# Altium schematic sheet IoT_Board_ESP32.SchDoc
size 420 x 297 mm; SheetNumber: 1; SheetTotal: 13
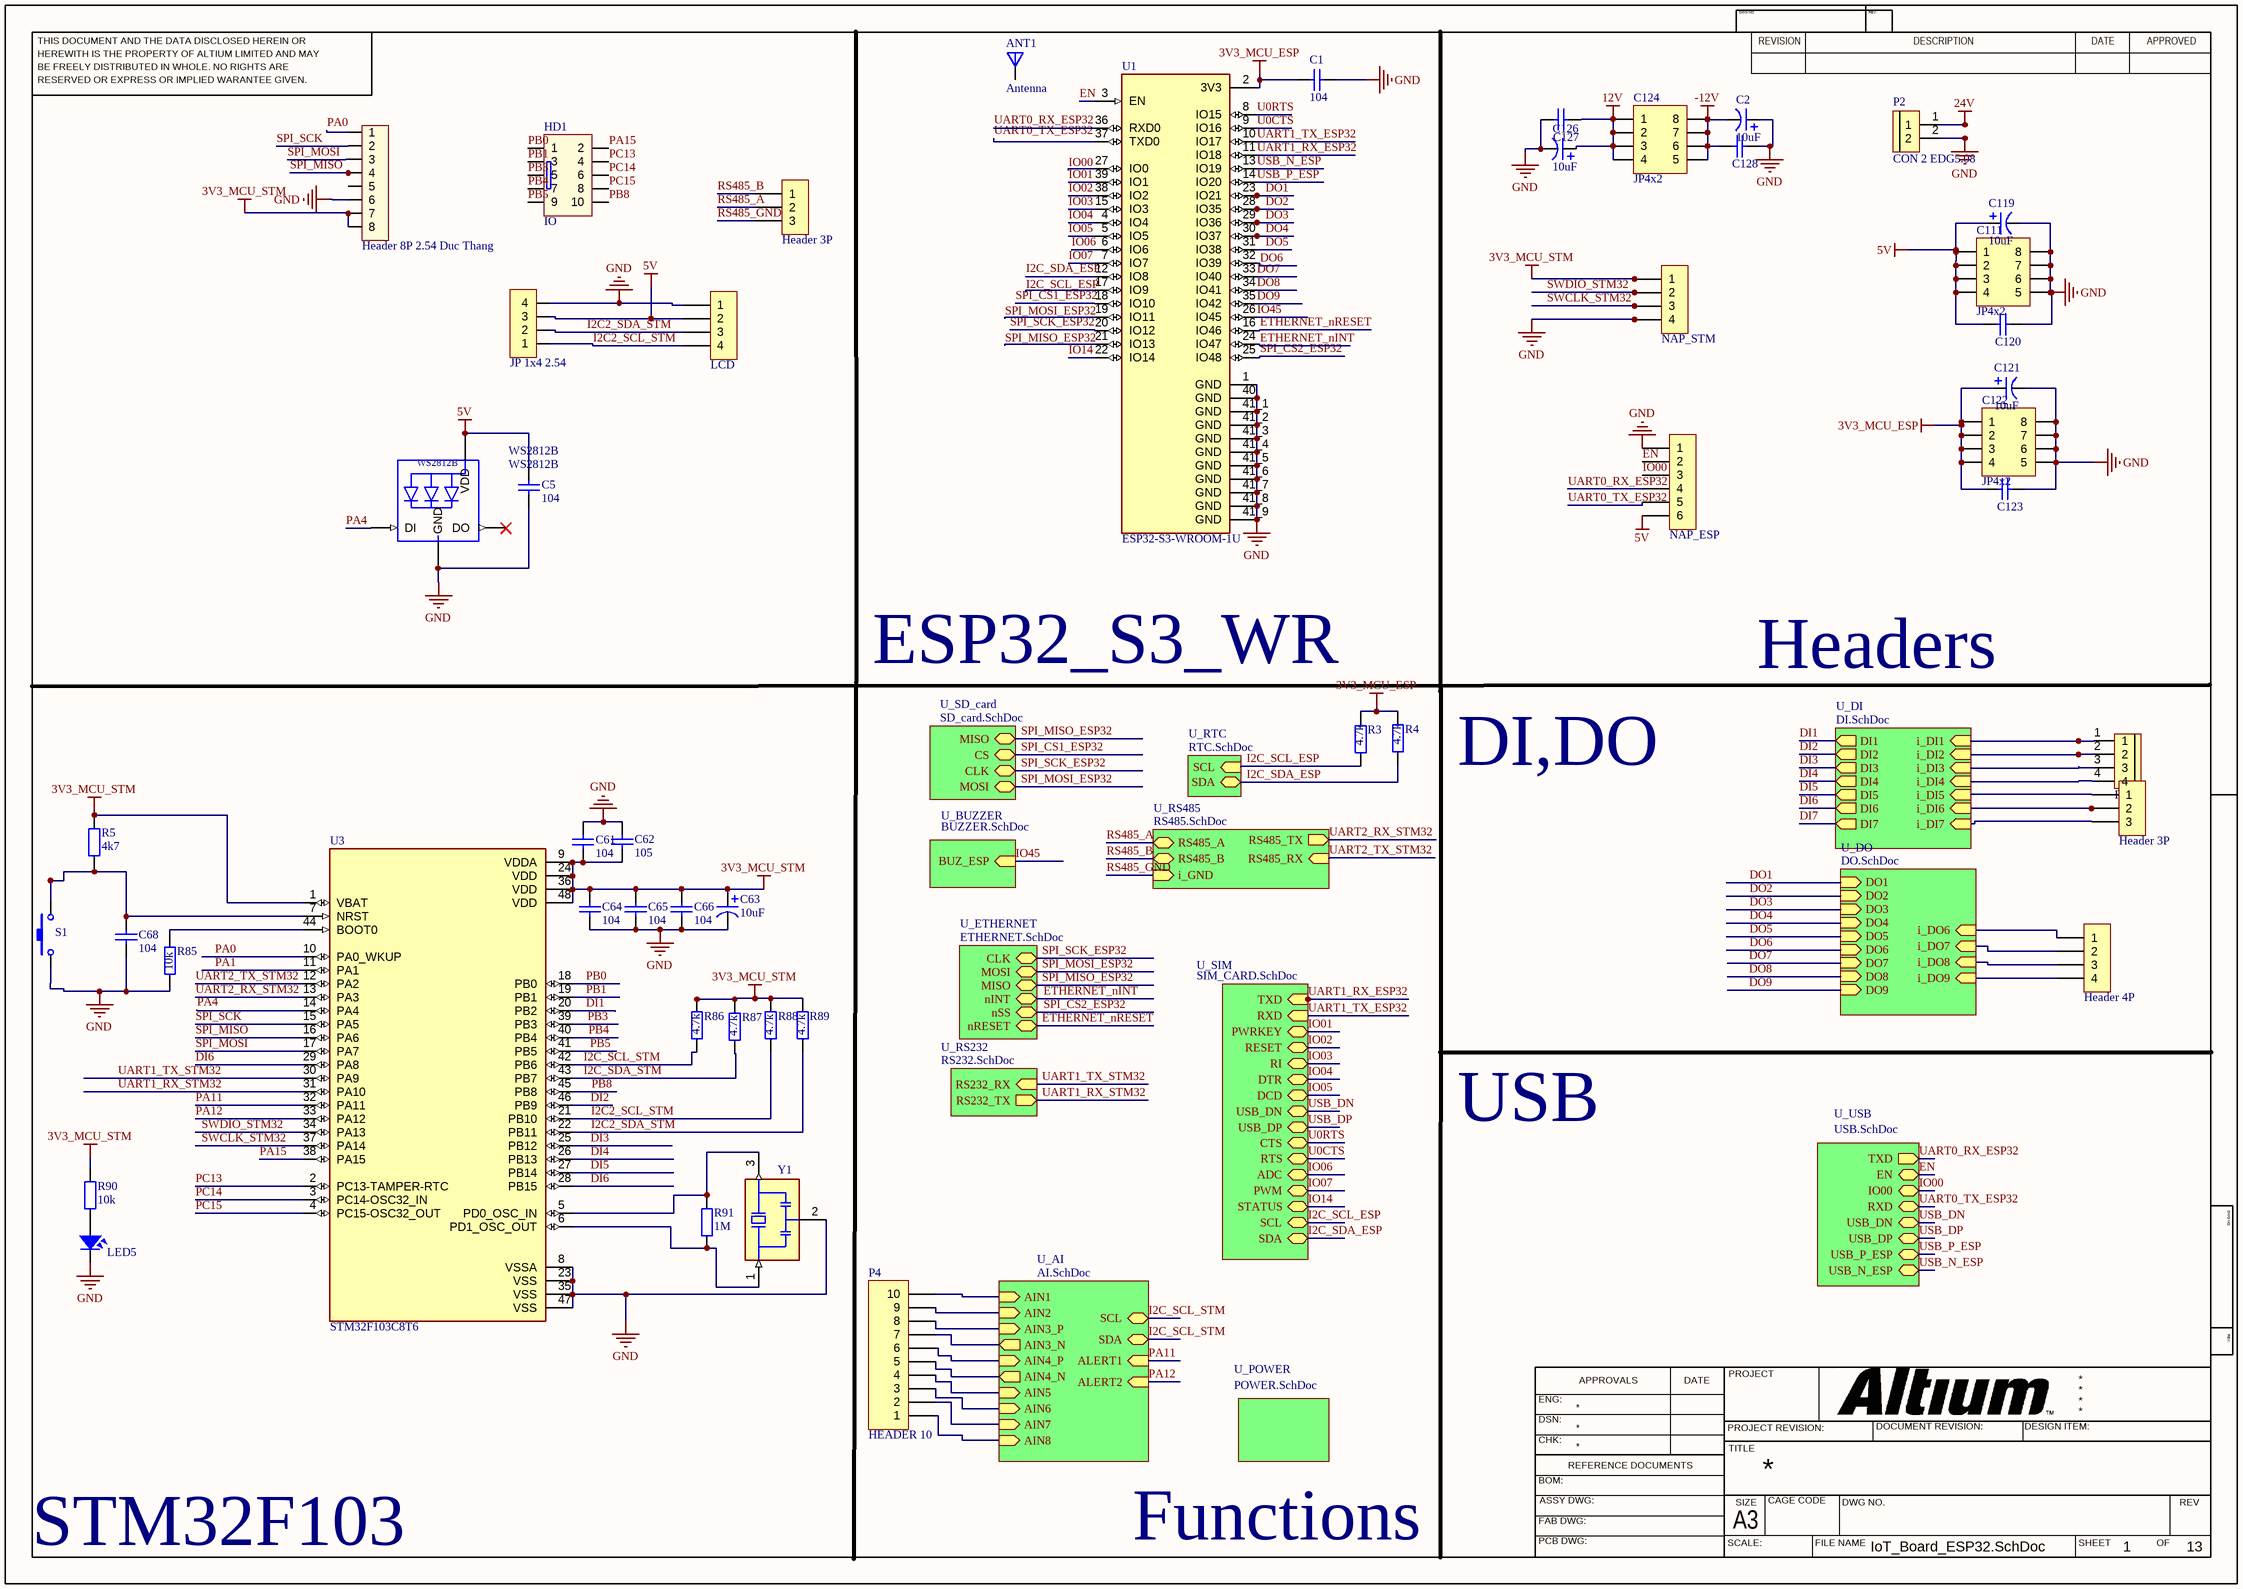
[diagram p0: IoT_Board_ESP32.SchDoc]

## Parts
ANT1  Antenna  [ANTENNA]
C1  104  [0603_Cap]
C2  10uF  [1206_CAP]
C5  104  [0603_Cap]
C61  104  [0603_Cap]
C62  105  [0603_Cap]
C63  10uF  [1206_CAP]
C64  104  [0603_Cap]
C65  104  [0603_Cap]
C66  104  [0603_Cap]
C68  104  [0603_Cap]
C111  JP4x2  [JP4-D2T]
C119  10uF  [1206_CAP]
C120  105  [0805_Cap]  (value not drawn)
C121  10uF  [1206_CAP]
C122  JP4x2  [JP4-D2T]
C123  105  [0805_Cap]  (value not drawn)
C124  JP4x2  [JP4-D2T]
C126  10uF  [1206_CAP]
C127  105  [0805_Cap]  (value not drawn)
C128  105  [0805_Cap]  (value not drawn)
H1  NAP_ESP  [XH2.54M-6]
H2  Header 3P  [CON 3 EDG5.08-3P]
H3  NAP_STM  [XH2.54M-4]
H4  Header 8P 2.54 Duc Thang  [XH2.54M-8]
H5  LCD  [XH2.54M-4]
H7  Header 3P  [CON 3 EDG5.08-3P]
H25  Header 4P  [CON 4 EDG5.08-4P]
HD1  IO  [IDC10]
JP1  JP 1x4 2.54  [JP 1x4 DT]
LED5  LED  [0603_LED]  (value not drawn)
P2  CON 2 EDG5.08  [CON 2 2EDG5.08]
P3  CON 4 EDG5.08  [CON 4 4EDG5.08]  (value not drawn)
P4  HEADER 10  [HT508R-10P]
R3  4.7k  [0603_Res]
R4  4.7k  [0603_Res]
R5  4k7  [0603_Res]
R85  10k  [0603_Res]
R86  4.7k  [0603_Res]
R87  4.7k  [0603_Res]
R88  4.7k  [0603_Res]
R89  4.7k  [0603_Res]
R90  10k  [0603_Res]
R91  1M  [0603_Res]
S1  SW  [BUTTON-SMD 2PIN]  (value not drawn)
U1  ESP32-S3-WROOM-1U  [XCVR_ESP32-S3-WROOM-1U]
U3  STM32F103C8T6  [LQFP-48]
WS2812B  WS2812B  [WS2812B]
Y1  CSTCE8M00G52-R0  [OSC_CSTCE8M00G52-R0]  (value not drawn)

## Sub-sheets
U_AI = AI.SchDoc: AIN1 (in), SCL (bidir), SDA (bidir), AIN2 (in), AIN3_P (in), AIN3_N (out), AIN4_P (in), AIN4_N (out), AIN5 (in), AIN6 (in), ALERT1 (in), ALERT2 (in), AIN7 (in), AIN8 (in)
U_BUZZER = BUZZER.SchDoc: BUZ_ESP (in)
U_DI = DI.SchDoc: i_DI1 (in), i_DI2 (in), i_DI3 (in), i_DI4 (in), DI1 (out), DI2 (out), DI3 (out), DI4 (out), i_DI5 (in), i_DI6 (in), DI5 (out), DI6 (out), DI7 (out), i_DI7 (in)
U_DO = DO.SchDoc: DO6 (in), DO5 (in), DO4 (in), DO3 (in), DO2 (in), DO1 (in), DO7 (in), DO8 (in), DO9 (in), i_DO8 (in), i_DO9 (in), i_DO7 (in), i_DO6 (in)
U_ETHERNET = ETHERNET.SchDoc: nRESET (bidir), nSS (bidir), nINT (bidir), MISO (bidir), MOSI (bidir), CLK (bidir)
U_POWER = POWER.SchDoc: no entries
U_RS232 = RS232.SchDoc: RS232_RX (in), RS232_TX (out)
U_RS485 = RS485.SchDoc: RS485_A (bidir), RS485_B (bidir), RS485_TX (out), RS485_RX (in), i_GND (in)
U_RTC = RTC.SchDoc: SCL (in), SDA (bidir)
U_SD_card = SD_card.SchDoc: CS (bidir), MOSI (bidir), CLK (bidir), MISO (bidir)
U_SIM = SIM_CARD.SchDoc: RXD (in), PWRKEY (bidir), RESET (bidir), RI (bidir), DTR (bidir), DCD (bidir), USB_DN (bidir), USB_DP (bidir), TXD (in), CTS (bidir), RTS (bidir), ADC (bidir), PWM (bidir), STATUS (bidir), SCL (bidir), SDA (bidir)
U_USB = USB.SchDoc: TXD (out), EN (bidir), IO00 (bidir), RXD (bidir), USB_DN (bidir), USB_DP (bidir), USB_P_ESP (bidir), USB_N_ESP (bidir)

## Nets
3V3_MCU_ESP: C1.2 C121.1 C122.1 C122.2 C122.3 C122.4 C123.1 R3.2 R4.2 U1.2(3V3)
3V3_MCU_STM: C61.2 C62.2 C63.1 C64.1 C65.1 C66.1 H3.1 H4.7 H4.8 R5.2 R86.2 R87.2 R88.2 R89.2 R90.2 U3.1(VBAT) U3.9(VDDA) U3.24(VDD) U3.36(VDD) U3.48(VDD)
5V: C5.1 C111.1 C111.2 C111.3 C111.4 C119.1 C120.1 H1.6 H5.2 JP1.3 WS2812B.1-VDD(VDD)
12V: C124.1 C124.2 C124.3 C124.4 C126.1 C127.1
24V: P2.1
-12V: C2.2 C124.5 C124.6 C124.7 C124.8 C128.1
GND: C1.1 C2.1 C5.2 C61.1 C62.1 C63.2 C64.2 C65.2 C66.2 C68.1 C111.5 C111.6 C111.7 C111.8 C119.2 C120.2 C121.2 C122.5 C122.6 C122.7 C122.8 C123.2 C126.2 C127.2 C128.2 H1.1 H3.4 H4.6 H5.1 JP1.4 LED5.C(Cathode) P2.2 R85.1 S1.1 U1.1(GND) U1.40(GND) U1.41_1(GND) U1.41_2(GND) U1.41_3(GND) U1.41_4(GND) U1.41_5(GND) U1.41_6(GND) U1.41_7(GND) U1.41_8(GND) U1.41_9(GND) U3.8(VSSA) U3.23(VSS) U3.35(VSS) U3.47(VSS) WS2812B.3-GND(GND) Y1.2(GND)
DI1: U3.20(PB2) ; sheet U_DI/DI1
DI2: U3.46(PB9) ; sheet U_DI/DI2
DI3: U3.25(PB12) ; sheet U_DI/DI3
DI4: U3.26(PB13) ; sheet U_DI/DI4
DI5: U3.27(PB14) ; sheet U_DI/DI5
DI6: U3.28(PB15) U3.29(PA8) ; sheet U_DI/DI6
DI7: sheet U_DI/DI7
DO1: U1.23(IO21) ; sheet U_DO/DO1
DO2: U1.28(IO35) ; sheet U_DO/DO2
DO3: U1.29(IO36) ; sheet U_DO/DO3
DO4: U1.30(IO37) ; sheet U_DO/DO4
DO5: U1.31(IO38) ; sheet U_DO/DO5
DO6: U1.32(IO39) ; sheet U_DO/DO6
DO7: U1.33(IO40) ; sheet U_DO/DO7
DO8: U1.34(IO41) ; sheet U_DO/DO8
DO9: U1.35(IO42) ; sheet U_DO/DO9
EN: H1.2 U1.3(EN) ; sheet U_USB/EN
ETHERNET_nINT: U1.24(IO47) ; sheet U_ETHERNET/nINT
ETHERNET_nRESET: U1.16(IO46) ; sheet U_ETHERNET/nRESET
I2C2_SCL_STM: H5.4 JP1.1 R88.1 U3.21(PB10)
I2C2_SDA_STM: H5.3 JP1.2 R89.1 U3.22(PB11)
I2C_SCL_ESP: R3.1 U1.17(IO9) ; sheet U_RTC/SCL, sheet U_SIM/SCL
I2C_SCL_STM: R86.1 U3.42(PB6) ; sheet U_AI/SCL, sheet U_AI/SDA
I2C_SDA_ESP: R4.1 U1.12(IO8) ; sheet U_RTC/SDA, sheet U_SIM/SDA
I2C_SDA_STM: R87.1 U3.43(PB7)
IO00: H1.3 U1.27(IO0) ; sheet U_USB/IO00
IO01: U1.39(IO1) ; sheet U_SIM/PWRKEY
IO02: U1.38(IO2) ; sheet U_SIM/RESET
IO03: U1.15(IO3) ; sheet U_SIM/RI
IO04: U1.4(IO4) ; sheet U_SIM/DTR
IO05: U1.5(IO5) ; sheet U_SIM/DCD
IO06: U1.6(IO6) ; sheet U_SIM/ADC
IO07: U1.7(IO7) ; sheet U_SIM/PWM
IO14: U1.22(IO14) ; sheet U_SIM/STATUS
IO45: U1.26(IO45) ; sheet U_BUZZER/BUZ_ESP
PA0: H4.1 U3.10(PA0_WKUP)
PA1: U3.11(PA1)
PA4: U3.14(PA4) WS2812B.4-DIN(DI)
PA11: U3.32(PA11) ; sheet U_AI/ALERT1
PA12: U3.33(PA12) ; sheet U_AI/ALERT2
PA15: HD1.2 U3.38(PA15)
PB0: HD1.1 U3.18(PB0)
PB1: HD1.3 U3.19(PB1)
PB3: HD1.5 U3.39(PB3)
PB4: HD1.7 U3.40(PB4)
PB5: HD1.9 U3.41(PB5)
PB8: HD1.10 U3.45(PB8)
PC13: HD1.4 U3.2(PC13-TAMPER-RTC)
PC14: HD1.6 U3.3(PC14-OSC32_IN)
PC15: HD1.8 U3.4(PC15-OSC32_OUT)
RS485_A: H7.2 ; sheet U_RS485/RS485_A
RS485_B: H7.1 ; sheet U_RS485/RS485_B
RS485_GND: H7.3 ; sheet U_RS485/i_GND
SPI_CS1_ESP32: U1.18(IO10) ; sheet U_SD_card/CS
SPI_CS2_ESP32: U1.25(IO48) ; sheet U_ETHERNET/nSS
SPI_MISO: H4.4 U3.16(PA6)
SPI_MISO_ESP32: U1.21(IO13) ; sheet U_ETHERNET/MISO, sheet U_SD_card/MISO
SPI_MOSI: H4.3 U3.17(PA7)
SPI_MOSI_ESP32: U1.19(IO11) ; sheet U_ETHERNET/MOSI, sheet U_SD_card/MOSI
SPI_SCK: H4.2 U3.15(PA5)
SPI_SCK_ESP32: U1.20(IO12) ; sheet U_ETHERNET/CLK, sheet U_SD_card/CLK
SWCLK_STM32: H3.3 U3.37(PA14)
SWDIO_STM32: H3.2 U3.34(PA13)
U0CTS: U1.9(IO16) ; sheet U_SIM/RTS
U0RTS: U1.8(IO15) ; sheet U_SIM/CTS
UART0_RX_ESP32: H1.4 U1.36(RXD0) ; sheet U_USB/TXD
UART0_TX_ESP32: H1.5 U1.37(TXD0) ; sheet U_USB/RXD
UART1_RX_ESP32: U1.11(IO18) ; sheet U_SIM/TXD
UART1_RX_STM32: U3.31(PA10) ; sheet U_RS232/RS232_TX
UART1_TX_ESP32: U1.10(IO17) ; sheet U_SIM/RXD
UART1_TX_STM32: U3.30(PA9) ; sheet U_RS232/RS232_RX
UART2_RX_STM32: U3.13(PA3) ; sheet U_RS485/RS485_TX
UART2_TX_STM32: U3.12(PA2) ; sheet U_RS485/RS485_RX
USB_DN: sheet U_SIM/USB_DN, sheet U_USB/USB_DN
USB_DP: sheet U_SIM/USB_DP, sheet U_USB/USB_DP
USB_N_ESP: U1.13(IO19) ; sheet U_USB/USB_N_ESP
USB_P_ESP: U1.14(IO20) ; sheet U_USB/USB_P_ESP
NetC68_2: C68.2 R5.1 S1.2 U3.7(NRST)
NetH2_1: H2.1 ; sheet U_DI/i_DI5
NetH2_2: H2.2 ; sheet U_DI/i_DI6
NetH2_3: H2.3 ; sheet U_DI/i_DI7
NetH25_1: H25.1 ; sheet U_DO/i_DO6
NetH25_2: H25.2 ; sheet U_DO/i_DO7
NetH25_3: H25.3 ; sheet U_DO/i_DO8
NetH25_4: H25.4 ; sheet U_DO/i_DO9
NetLED5_A: LED5.A(Anode) R90.1
NetP3_1: P3.1 ; sheet U_DI/i_DI1
NetP3_2: P3.2 ; sheet U_DI/i_DI2
NetP3_3: P3.3 ; sheet U_DI/i_DI3
NetP3_4: P3.4 ; sheet U_DI/i_DI4
NetP4_1: P4.1 ; sheet U_AI/AIN8
NetP4_2: P4.2 ; sheet U_AI/AIN7
NetP4_3: P4.3 ; sheet U_AI/AIN6
NetP4_4: P4.4 ; sheet U_AI/AIN5
NetP4_5: P4.5 ; sheet U_AI/AIN4_N
NetP4_6: P4.6 ; sheet U_AI/AIN4_P
NetP4_7: P4.7 ; sheet U_AI/AIN3_N
NetP4_8: P4.8 ; sheet U_AI/AIN3_P
NetP4_9: P4.9 ; sheet U_AI/AIN2
NetP4_10: P4.10 ; sheet U_AI/AIN1
NetR85_2: R85.2 U3.44(BOOT0)
NetR91_1: R91.1 U3.6(PD1_OSC_OUT) Y1.1(IN)
NetR91_2: R91.2 U3.5(PD0_OSC_IN) Y1.3(OUT)

Not connected (* = marked no-connect by the designer): ANT1 1(ANT); H4 5; WS2812B 2-DOUT(DO)

## Notes on the sheet
- ESP32_S3_WR
- Headers
- DI,DO
- USB
- STM32F103
- Functions
- THIS DOCUMENT AND THE DATA DISCLOSED HEREIN OR
- HEREWITH IS THE PROPERTY OF ALTIUM LIMITED AND MAY
- DWG NO:
- REVISION
- REV:
- DESCRIPTION
- DATE
- APPROVED
- BE FREELY DISTRIBUTED IN WHOLE. NO RIGHTS ARE
- RESERVED OR EXPRESS OR IMPLIED WARANTEE GIVEN.
- ENG:
- APPROVALS
- PROJECT
- DSN:
- CHK:
- REFERENCE DOCUMENTS
- PROJECT REVISION:
- TITLE
- DOCUMENT REVISION:
- DESIGN ITEM:
- BOM:
- FAB DWG:
- PCB DWG:
- ASSY DWG:
- SCALE:
- A3
- SIZE
- CAGE CODE
- FILE NAME
- DWG NO.
- SHEET
- OF
- REV

## Library data of the parts
C1 C5 C61 C62 C64-C66 C68 C120 C123 C127 C128 = Ceramic Capacitor: Chung_Loai: Dán; Don_Vi: Con; So_Chan: 2; Ten_Linh_Kien: Tụ 0805 104-100nF 10% 50V; Ma_Hang: MH004551; Kieu_Chan: *
C2 C63 C119 C121 C126 = Polarized Capacitor
C111 C122 C124 = JP4x2: WR-PHD 2.54 mm Dual Socket Header; Manufacturer: W¨¹rth Elektronik eiSos GmbH; partNo: 61300821821; ComponentLink1 Description: Manufacturer; ComponentLink2 Description: Datasheet; NoPins: 08; Created Date: 29 March 2013; ComponentLink1URL: http://www.we-online.com; ComponentLink2URL: http://katalog.we-online.de/em/datasheet/6130xx21821.pdf; Created by: Karrer Zheng
H1 = Header 6P: THT; Ten_Linh_Kien: Header 6P XH2.54-6P Đực Cong; Don_Vi: Con; Ma_Hang: MH003363; Chung_Loai: Cắm
H2 H7 = Header 3P: THT; Ten_Linh_Kien: Header 3P XH2.54-3P Đực Cong; Don_Vi: Con; Ma_Hang: MH001302; Chung_Loai: Cắm
H3 H5 = Header 4P 2.54 Duc Thang: Cắm; Ten_Linh_Kien: Header 4P XH2.54-4P Đực Thẳng; Don_Vi: Con; Ma_Hang: MH001285; Chung_Loai: Cắm
H4 = Header 8P 2.54 Duc Thang: Cắm; Ten_Linh_Kien: Header 8P XH2.54-8P Đực Thẳng; Don_Vi: Con; Ma_Hang: MH003366; Chung_Loai: Cắm
H25 = Header 4P: THT; Ten_Linh_Kien: Header 4P XH2.54-4P Đực Cong; Don_Vi: Con; Ma_Hang: MH001310; Chung_Loai: Cắm
HD1 = IDC 5X2: Value: Header 5x2
JP1 = JP 1x4 2.54 Duc Thang: Cắm; Ten_Linh_Kien: Jump Đơn Đực 2.54MM 1x40P Thẳng 11MM; Don_Vi: Con; Ma_Hang: MH000903; Ghi_Chu: *; Kieu_Chan: *; Chung_Loai: Cắm
LED5 = LED: LED single color 2 leads
P2 = CON 2 EDG5.08: Cắm; Ten_Linh_Kien: CON 2 2EDG5.08-2P 5.08MM ( Xanh Cong); Ma_Hang: MH000759; Ghi_Chu: *; Don_Vi: Con; Kieu_Chan: *; Chung_Loai: Cắm
P3 = CON 4 EDG5.08: Cắm; Ten_Linh_Kien: CON 4 2EDG5.08-4P 5.08MM ( Xanh Cong); Ma_Hang: MH000979; Don_Vi: Con; Ghi_Chu: *; Kieu_Chan: *; Chung_Loai: Cắm
R3-R5 R85-R91 = Resistor: Chung_Loai: Dán; Don_Vi: Con; So_Chan: 2; Ten_Linh_Kien: Trở 0805 1% 1k; Ma_Hang: MH005468; Kieu_Chan: *
S1 = SW-Button: Switch-Button; Published: 24-Mar-1999; LatestRevisionDate: 17-Jul-2002; LatestRevisionNote: Re-released for DXP Platform.; PackageReference: SPST-2; Publisher: Altium Limited
U1 = ESP32-S3-WROOM-1U: 2.4 GHz Wi-Fi (802.11 b/g/n) and Bluetooth 5 (LE) module; MF: Espressif Systems; Value: *; Package: Package; Check_prices: https://www.snapeda.com/parts/ESP32-S3-WROOM-1U/Espressif+Systems/view-part/?ref=eda; Price: None; MP: ESP32-S3-WROOM-1U; Availability: Not in stock; SnapEDA_Link: https://www.snapeda.com/parts/ESP32-S3-WROOM-1U/Espressif+Systems/view-part/?ref=snap
U3 = STM32F103C8T6: ARMÂ® CortexÂ®-M3 STM32F1 Microcontroller IC 32-Bit 72MHz 64KB (64K x 8) FLASH 48-LQFP (7x7); MF: STMicroelectronics; Price: None; Availability: In Stock; MP: STM32F103C8T6; Package: LQFP-48 STMicroelectronics; SnapEDA_Link: https://www.snapeda.com/parts/STM32F103C8T6/STMicroelectronics/view-part/?ref=snap; Check_prices: https://www.snapeda.com/parts/STM32F103C8T6/STMicroelectronics/view-part/?ref=eda; Value: *; Purchase-URL: https://pricing.snapeda.com/search/part/STM32F103C8T6/?ref=eda
Y1 = CSTCE8M00G52-R0: 8MHz Ceramic Resonator Built in Capacitor 10pF Â±0.2% -20Â°C ~ 80Â°C Surface Mount; MF: Murata; Price: None; Check_prices: https://www.snapeda.com/parts/CSTCE8M00G52-R0/Murata%20Electronics%20North%20America/view-part/234504/?ref=eda; SnapEDA_Link: https://www.snapeda.com/parts/CSTCE8M00G52-R0/Murata%20Electronics%20North%20America/view-part/234504/?ref=snap; Package: Surface Mount Murata Electronics North America; Availability: Bad; MP: CSTCE8M00G52-R0; Value: *